# EAGLE design LCD-0.2 (EAGLE 7.6.0)
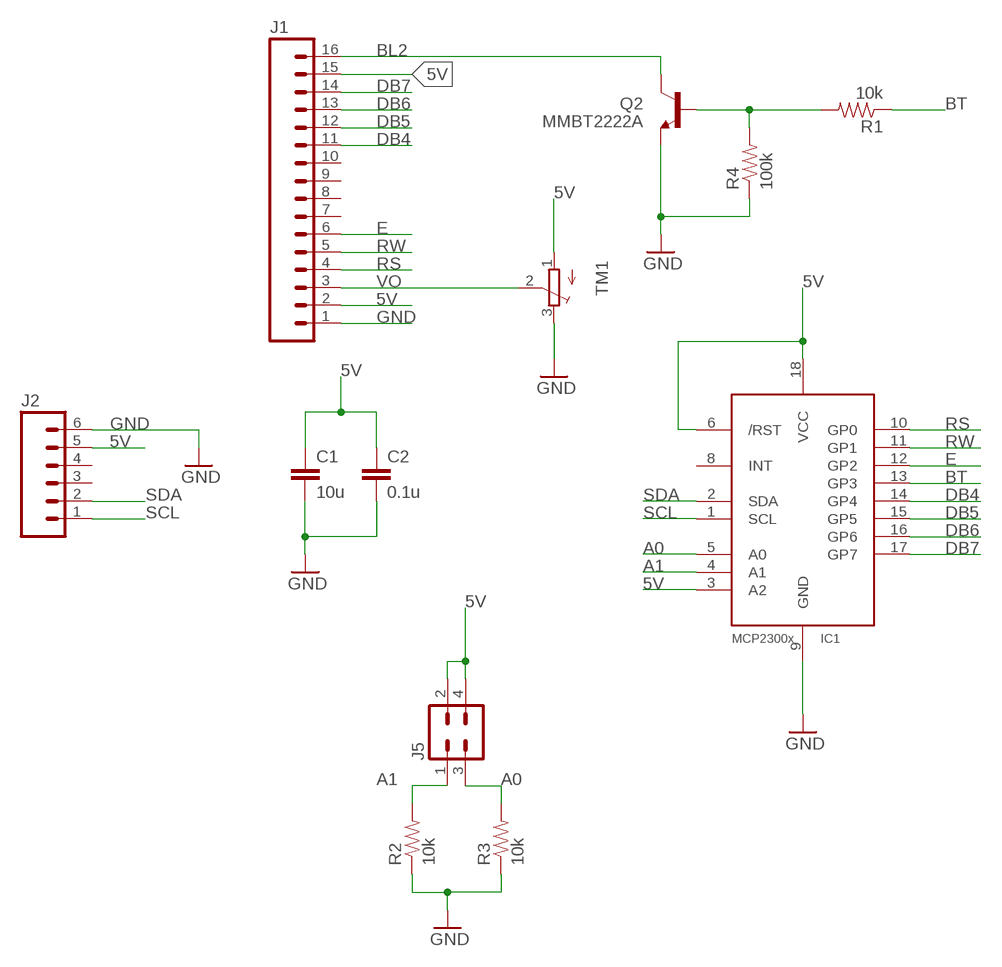
[diagram p0: schematic, sheet 1]

## Parts
C1  10u  CAP0603-CAP  [0603-CAP]
C2  0.1u  CAP0603-CAP  [0603-CAP]
IC1  MCP23008/SO  [SO18W]
J1  M16PTH  [1X16]
J2  M06RJ11  [RJ11-6P6C]
J5  M02X2  [2X2]
Q2  MMBT2222A  TRANSISTOR_NPNMMBT2222A  [SOT23-3]
R1  10k  RESISTOR0603  [0603-RES]
R2  10k  RESISTOR0603  [0603-RES]
R3  10k  RESISTOR0603  [0603-RES]
R4  100k  RESISTOR0603  [0603-RES]
TM1  TRIMPOTTC33X  [TC33X]

## Nets
5V: C1.1 C2.1 IC1.3(A2) IC1.6(/RST) IC1.18(VCC) J1.2 J1.15 J2.5 J5.2 J5.4 TM1.1(A)
A0: IC1.5(A0) J5.3 R3.2
A1: IC1.4(A1) J5.1 R2.2
BL2: J1.16 Q2.3(C)
BT: IC1.13(GP3) R1.1
DB4: IC1.14(GP4) J1.11
DB5: IC1.15(GP5) J1.12
DB6: IC1.16(GP6) J1.13
DB7: IC1.17(GP7) J1.14
E: IC1.12(GP2) J1.6
GND: C1.2 C2.2 IC1.9(GND) J1.1 J2.6 Q2.2(E) R2.1 R3.1 R4.1 TM1.3(E)
N$1: Q2.1(B) R1.2 R4.2
RS: IC1.10(GP0) J1.4
RW: IC1.11(GP1) J1.5
SCL: IC1.1(SCL) J2.1
SDA: IC1.2(SDA) J2.2
VO: J1.3 TM1.2(S)
Unconnected: IC1.8(INT) J1.7 J1.8 J1.9 J1.10 J2.3 J2.4

## Library data of the parts
C1 C2 = SparkFun-Capacitors:CAP: Capacitor Standard 0603 ceramic capacitor, and 0.1" leaded capacitor.
IC1 = adafruit:MCP23008: MCP23008 Inexpensive i2c i/o expander - 8 general purpose i/o pins with optional pullups
J1 = SparkFun-Connectors:M16: 1x16 .1" header
J2 = Robotois:M06: Header 6 Standard 6-pin 0.1" header. Use with straight break away headers (SKU : PRT-00116), right angle break away headers (PRT-00553), swiss pins (PRT-00743), machine pins (PRT-00117), and female headers (PRT-00115). Molex polarized connector foot print use with SKU : PRT-08094 with associated crimp pins and housings. NOTES ON THE VARIANTS LOCK and LOCK_LONGPADS... This footprint was designed to help hold the alignment of a through-hole component (i.e. 6-pin header) while soldering it into place. You may notice that each hole has been shifted either up or down by 0.005 of an inch from it's more standard position (which is a perfectly straight line). This slight alteration caused the pins (the squares in the middle) to touch the edges of the holes. Because they are alternating, it causes a "brace" to hold the component in place. 0.005 has proven to be the perfect amount of "off-center" position when using our standard breakaway headers. Although looks a little odd when you look at the bare footprint, once you have a header in there, the alteration is very hard to notice. Also,if you push a header all the way into place, it is covered up entirely on the bottom side. This idea of altering the position of holes to aid alignment will be further integrated into the Sparkfun Library for other footprints. It can help hold any component with 3 or more connection pins.
J5 = Robotois:M02X2: .1" header, two rows of four.
Q2 = SparkFun-DiscreteSemi:TRANSISTOR_NPN: Generic NPN BJT MMBT2222A - TRANS-08049 (SOT-23, 1A 40V) MPSA42 - TRANS-09116 (SOT-23, 500mA 300V) MMBT5088LT1G - TRANS-11160 (SOT-23, 50 mA 30V) BC547 - COM-08928 <http://www.sparkfun.com/products/8928> (TO-92 45V 100mA) (1.Collector 2.Base 3.Emitter) 2N3904 - COM-00521 <http://www.sparkfun.com/products/521> (TO-92 40V 200mA) (1.Emitter 2.Base 3.Collector) P2N2222A - COM-12852 <http://www.sparkfun.com/products/12852> (TO-92 40V 600mA) (1.Collector 2.Base 3.Emitter); PROD_ID: TRANS-08049
R1-R4 = SparkFun-Resistors:RESISTOR: Resistor Basic schematic elements and footprints for 0603, 1206, and PTH resistors.
TM1 = Robotois:TRIMPOT: SMT trimmer potentiometer part number TC33X http://www.ladyada.net/library/eagle

## Board
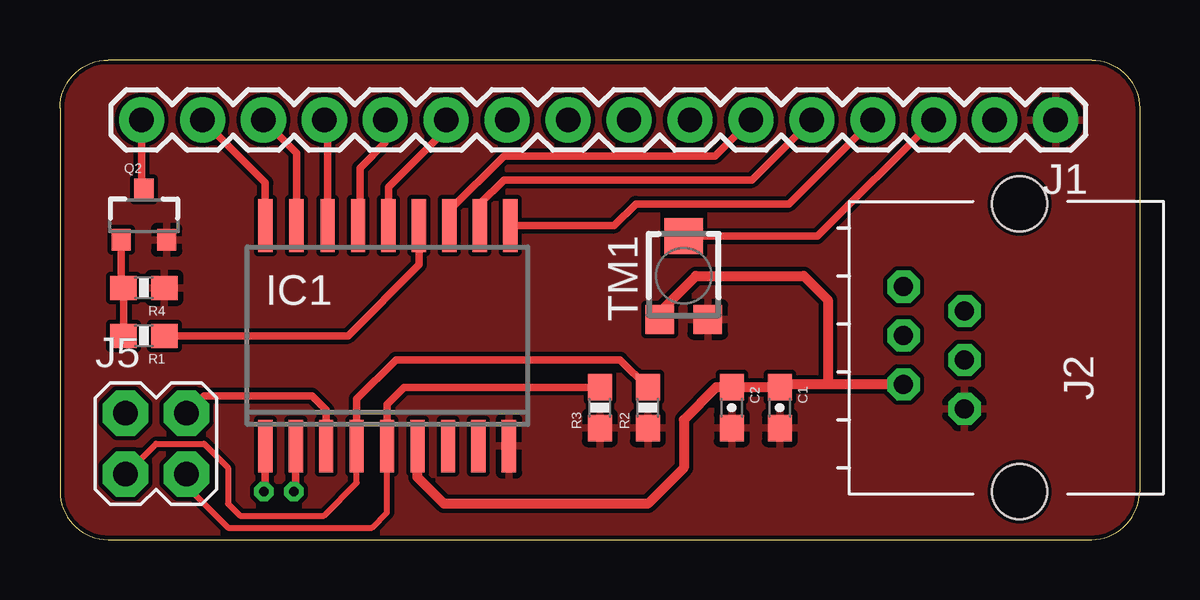
[diagram p1: board, top side]
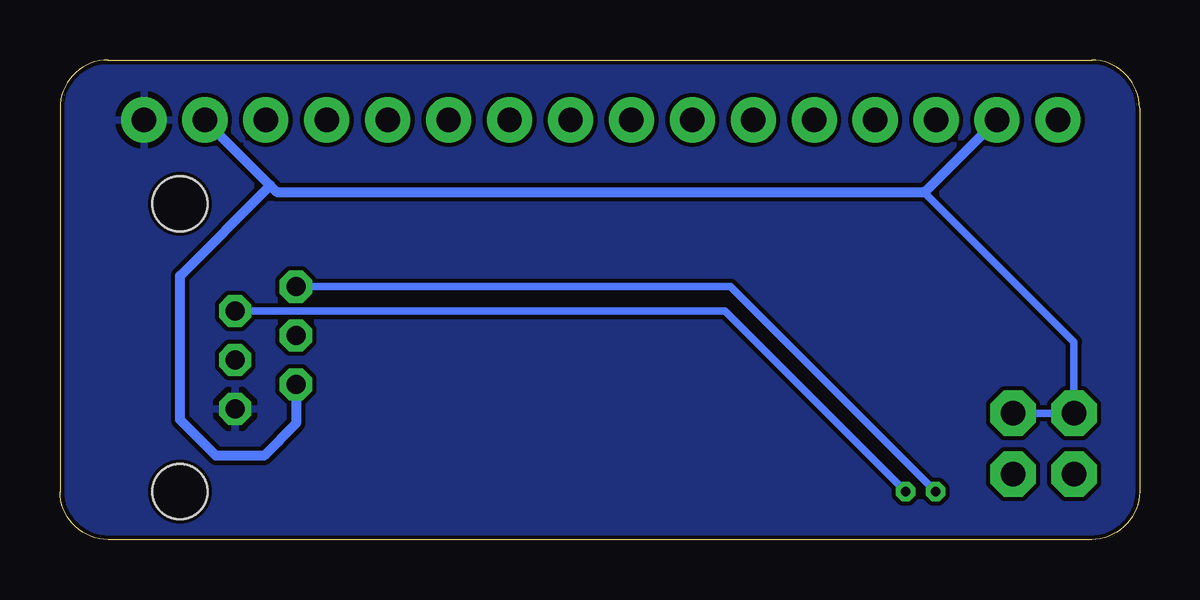
[diagram p2: board, bottom side, seen from below]

Size 45 x 20 mm. Coordinates in mm from the lower left corner, seen from the top.
Outline: 2,0 43,0 arc90 45,2 45,18 arc90 43,20 2,20 arc90 0,18 0,2 arc90 2,0
Copper layers (1*16): Top 0.035mm / dielectric 1.5mm / Bottom 0.035mm
Design rules "SparkFun-2-layer-TIGHT": minimum track width 7mil, minimum drill 15mil, track to track 7mil, track to pad 7mil, pad to pad 7mil, via to via 7mil, smd to smd 7mil, copper to edge 7mil, drill to drill 7mil, minimum pad ring 7mil, minimum via ring 7mil, stop-mask expansion 4mil, vias tented up to drill 25mil, thermal gap 10mil

### Footprints (pad centres in the part's own frame; a part is rotated, then mirrored left to right if it is on the bottom)
0603-CAP = smd 1.1 x 1: 1 -0.85,0; 2 0.85,0
SO18W = smd 0.6 x 2.2: 1 -4.445,-4.6; 2 -3.175,-4.6; 3 -1.905,-4.6; 4 -0.635,-4.6; 5 0.635,-4.6; 6 1.905,-4.6; 7 3.175,-4.6; 8 4.445,-4.6; 9 5.715,-4.6; 10 5.775,4.6; 11 4.505,4.6; 12 3.235,4.6; 13 1.965,4.6; 14 0.695,4.6; 15 -0.575,4.6; 16 -1.845,4.6; 17 -3.145,4.6; 18 -4.445,4.6
1X16 = drill 1.016 pad 1.88: 1 0,0; 2 2.54,0; 3 5.08,0; 4 7.62,0; 5 10.16,0; 6 12.7,0; 7 15.24,0; 8 17.78,0; 9 20.32,0; 10 22.86,0; 11 25.4,0; 12 27.94,0; 13 30.48,0; 14 33.02,0; 15 35.56,0; 16 38.1,0
RJ11-6P6C = drill 0.8 pad 1.35 octagon: 1 2.55,4.84; 2 1.53,2.3; 3 0.51,4.84; 4 -0.51,2.3; 5 -1.53,4.84; 6 -2.55,2.3 | hole 2.3: -6,0; 6,0
2X2 = drill 1.016 pad 1.88 octagon: 1 -1.27,-1.27; 2 -1.27,1.27; 3 1.27,-1.27; 4 1.27,1.27
SOT23-3 = smd 0.8 x 0.9: 1 -0.95,-1; 2 0.95,-1; 3 0,1.1
0603-RES = smd 1.1 x 1: 1 -0.85,0; 2 0.85,0
TC33X = smd 1.2 x 1.2: 1 -1,-1.825; 3 1,-1.825 | smd 1.6 x 1.5: 2 0,1.65

### Placement (x,y rotation side)
C1  30,5.5 270 top
C2  28,5.5 270 top
IC1  13,8.5 0 top
J1  41.5,17.5 180 top
J2  40,8 90 top
J5  4,4 0 top
Q2  3.5,13.5 0 top
R1  3.5,8.5 180 top
R2  24.5,5.5 90 top
R3  22.5,5.5 90 top
R4  3.5,10.5 180 top
TM1  26,11 0 top

### Tracks (layer width: path | path; a pad name or v marks a point on that pad's centre or on a via)
5V
  Top 0.305: IC1.18 8.55,14.88 J1.15 | IC1.3 11.1,5.41 10.5,6 6,6 J5.4
  Top 0.406: J2.5 32,6.47 | 32,6.47 30.12,6.47 C1.1 C2.1 27.35,6.35 26,5 26,3 24.5,1.5 16,1.5 14.9,2.6 IC1.6 | TM1.1 25,9.5 26.5,11 31,11 32,10 32,6.47
  Bottom 0.305: 9,14.5 2.73,8.23 J5.2 J5.4
  Bottom 0.406: J2.5 35.16,4.84 36.5,3.5 38.5,3.5 40,5 40,11 36.23,14.77 | J1.2 36.23,14.77 | 36.23,14.77 35.96,14.5 9,14.5 8.94,14.5 J1.15
A0
  Top 0.254: J5.3 5.27,2.23 7,0.5 13,0.5 13.63,1.14 IC1.5
  Top 0.305: R3.2 14.35,6.35 13.63,5.63 IC1.5
A1
  Top 0.254: J5.1 4,4 6,4 7,3 7,1.5 7.5,1 11,1 12.37,2.37 IC1.4
  Top 0.305: R2.2 23.35,7.5 14,7.5 12.37,5.87 IC1.4
BL2
  Top 0.305: Q2.3 3.4,14.6 J1.16
BT
  Top 0.305: 15,13.06 IC1.13 14.96,11.46 12,8.5 R1.1
DB4
  Top 0.305: IC1.14 13.7,14.7 16.1,17.1 J1.11
DB5
  Top 0.305: IC1.15 12.5,13.18 12.5,15.5 13.56,16.56 J1.12
DB6
  Top 0.305: IC1.16 11.15,17.36 J1.13
DB7
  Top 0.305: IC1.17 9.86,16.12 J1.14
E
  Top 0.305: IC1.12 16.23,13.73 18.5,16 27.3,16 J1.6
GND
  pour Top (rank 2): -2,22 -2,-2 52,-2 52,22
  pour Bottom: -1,21 -1,-1 51,-1 51,21
N$1
  Top 0.305: R1.2 R4.2 2.55,10.6 Q2.1
RS
  Top 0.305: IC1.10 23.1,13.1 24,14 30.38,14 J1.4
RW
  Top 0.305: IC1.11 17.5,14.01 18.5,15 28.84,15 J1.5
SCL  (via drill 0.4 pad 0.8)
  Top 0.305: IC1.1 8.55,2.06 v8.5,2
  Bottom 0.305: J2.1 17.05,10.55 v8.5,2
SDA  (via drill 0.4 pad 0.8)
  Top 0.305: IC1.2 9.82,2.08 v9.75,2
  Bottom 0.305: J2.2 17.28,9.53 v9.75,2
VO
  Top 0.305: TM1.2 31.57,12.65 J1.3